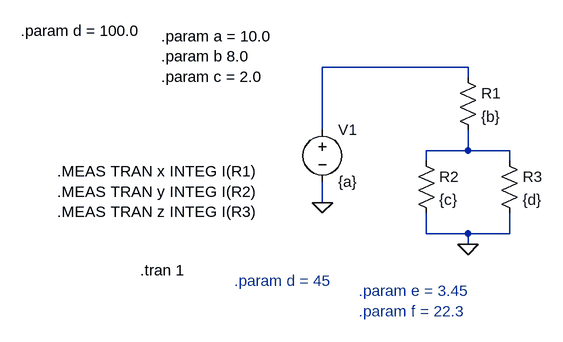
[diagram p0: schematic test2.asc]
test2.asc, the LTspice schematic file:
Version 4
SHEET 1 880 680
WIRE 288 48 64 48
WIRE 288 64 288 48
WIRE 64 144 64 48
WIRE 288 176 288 144
WIRE 288 176 224 176
WIRE 352 176 288 176
WIRE 224 192 224 176
WIRE 352 192 352 176
WIRE 64 256 64 224
WIRE 224 304 224 272
WIRE 288 304 224 304
WIRE 352 304 352 272
WIRE 352 304 288 304
WIRE 288 320 288 304
FLAG 288 320 0
FLAG 64 256 0
SYMBOL voltage 64 128 R0
SYMATTR InstName V1
SYMATTR Value {a}
SYMBOL res 272 48 R0
SYMATTR InstName R1
SYMATTR Value {b}
SYMBOL res 208 176 R0
SYMATTR InstName R2
SYMATTR Value {c}
SYMBOL res 336 176 R0
SYMATTR InstName R3
SYMATTR Value {d}
TEXT -184 0 Left 2 !.param a = 10.0\n.param b 8.0\n.param c = 2.0
TEXT -216 360 Left 2 !.tran 1
TEXT -344 208 Left 2 !.MEAS TRAN x INTEG I(R1)\n.MEAS TRAN y INTEG I(R2)\n.MEAS TRAN z INTEG I(R3)
TEXT -400 -8 Left 2 !.param d = 100.0
TEXT -72 376 Left 2 ;.param d = 45
TEXT 120 392 Left 2 ;.param e = 3.45\n.param f = 22.3

The netlist it stands for:
* test2.asc
V1 N001 0 {a}
R1 N001 N002 {b}
R2 N002 0 {c}
R3 N002 0 {d}
.param a = 10.0
.param b 8.0
.param c = 2.0
.tran 1
.MEAS TRAN x INTEG I(R1)
.MEAS TRAN y INTEG I(R2)
.MEAS TRAN z INTEG I(R3)
.param d = 100.0
* .param d = 45
* .param e = 3.45
* .param f = 22.3
.backanno
.end